# EasyEDA Pro project 仿生青蛙驱动控制板-STM32F1-3.0.eprj

# Schematic Schematic1
Create Date: 2024-03-05; Page Name: P1; Project Name: 仿生青蛙驱动控制板-STM32F1-3.0; Schematic Name: Schematic1; Update Date: 2024-03-24; Company: 嘉立创EDA; Page Size: A4; Version: V1.0
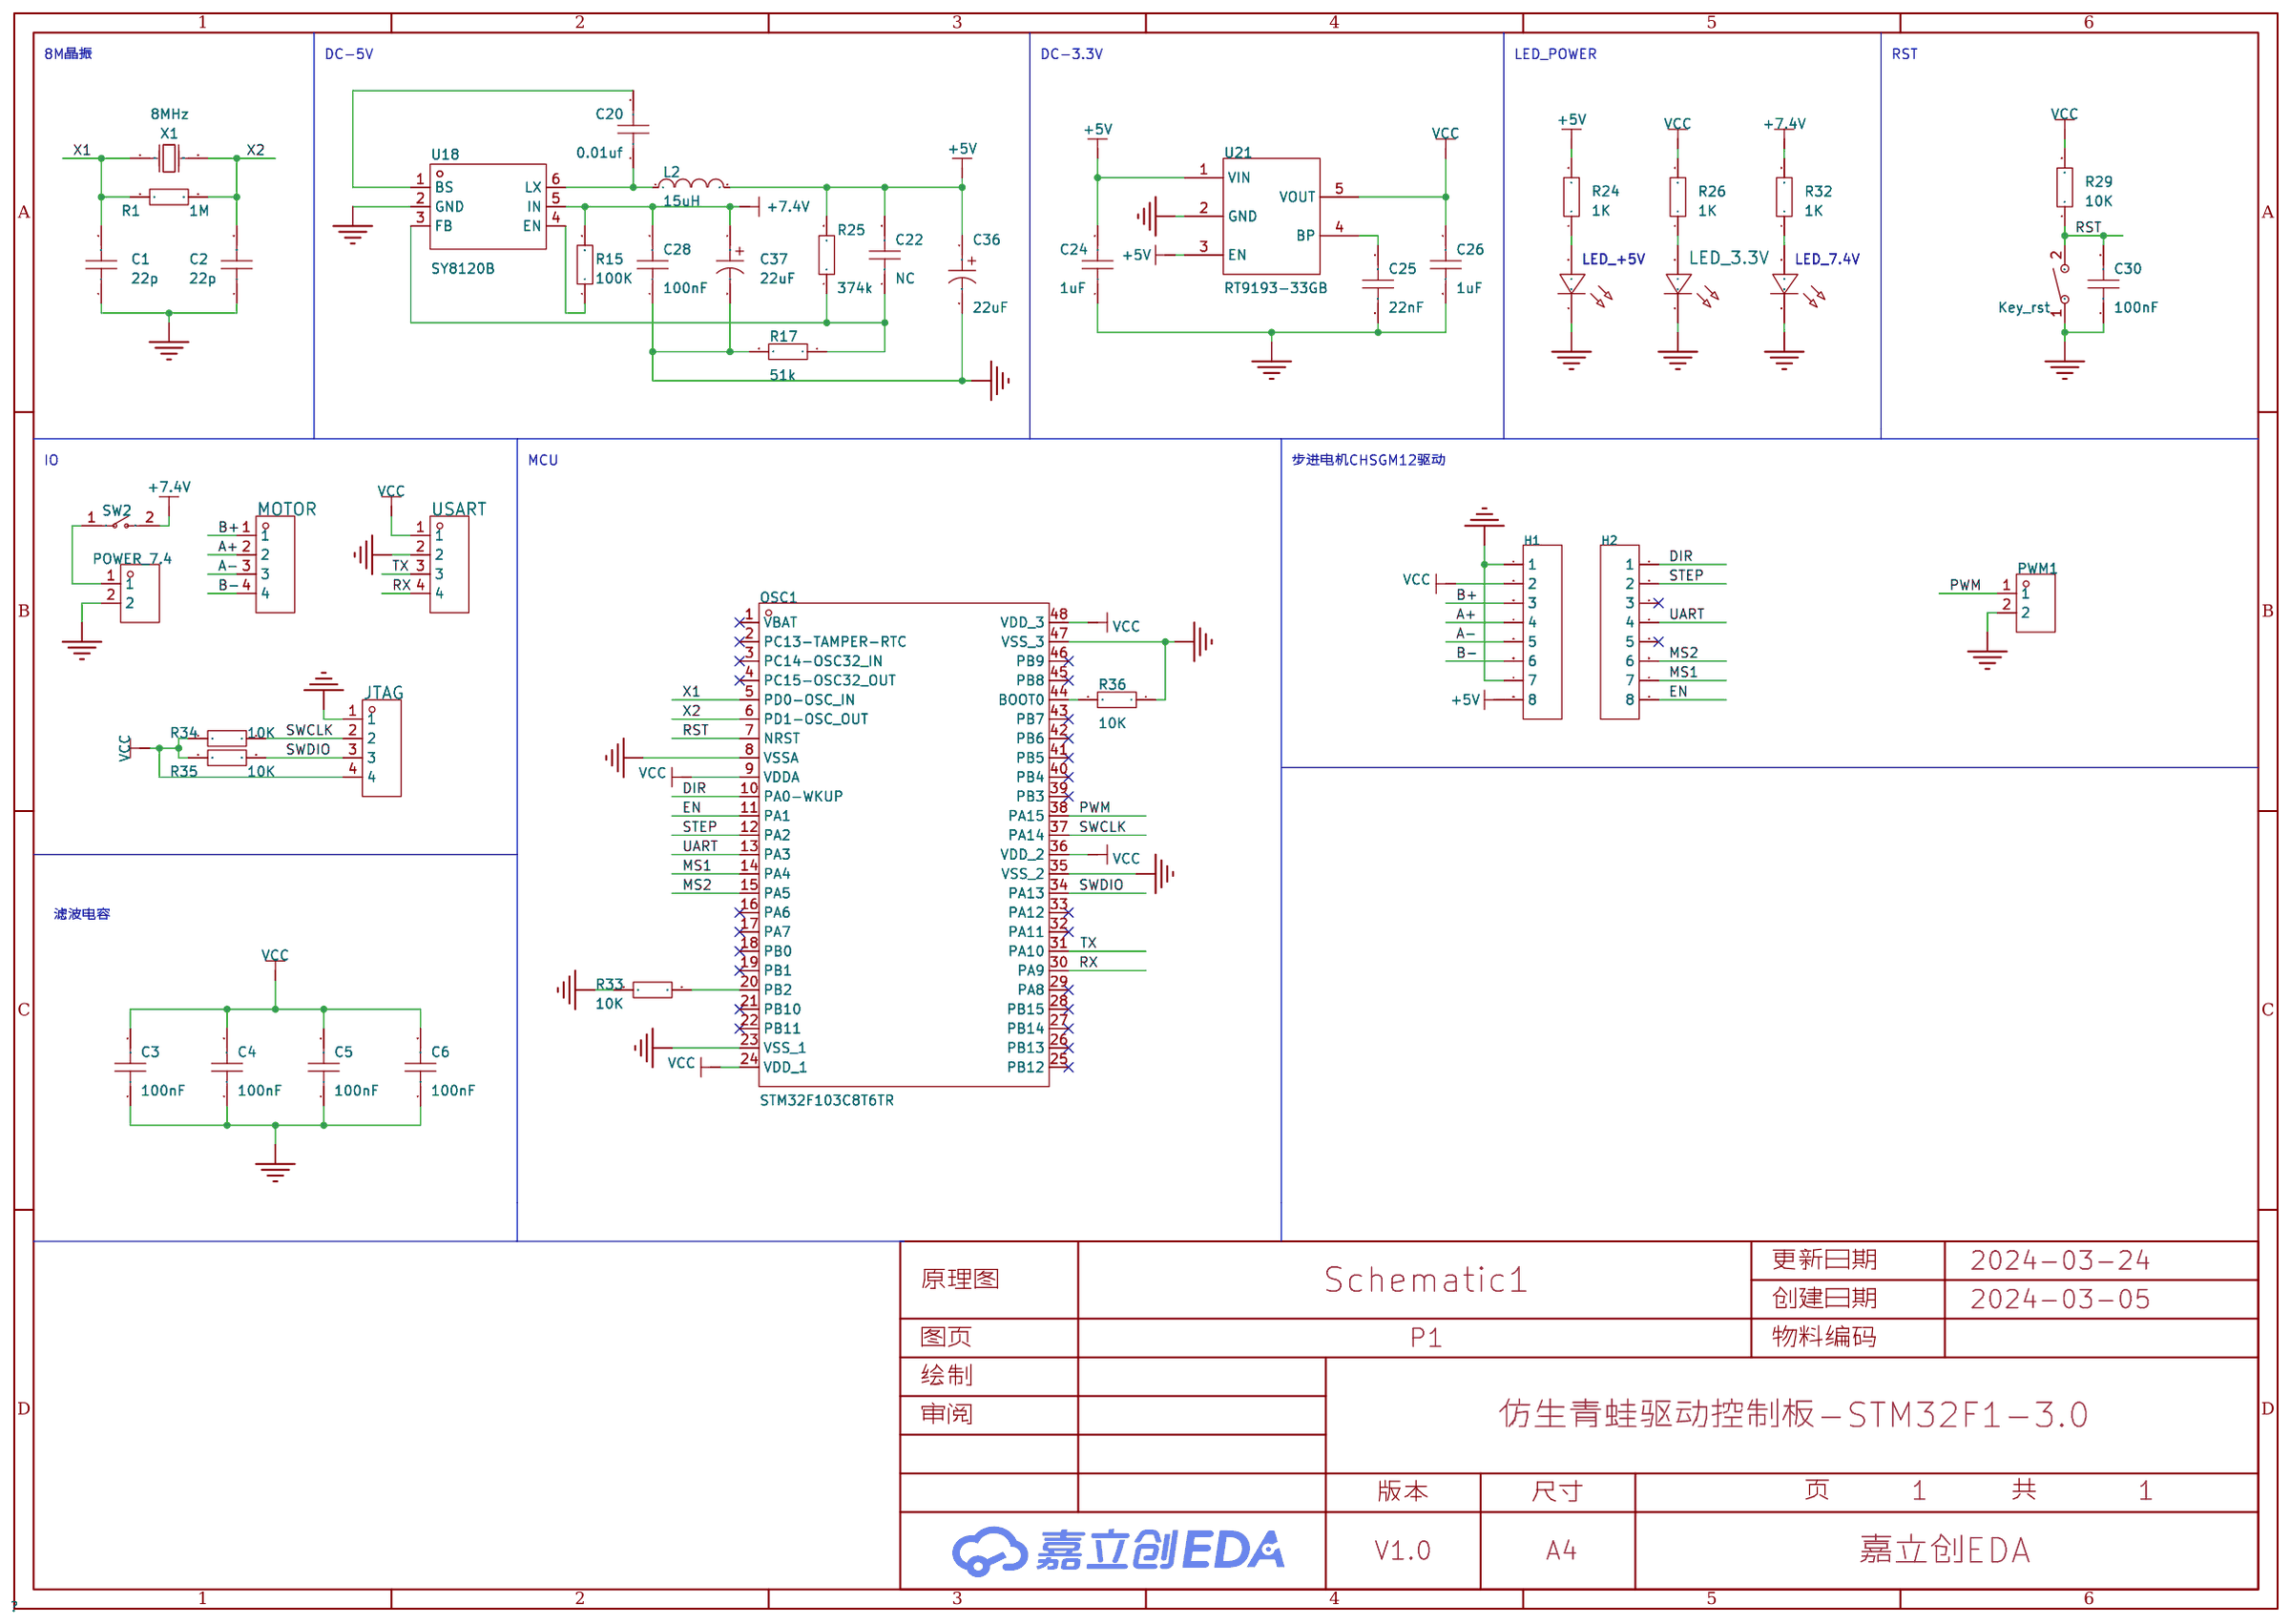
[diagram p0: schematic sheet]

## Parts
C1  22p  [c0603]
C2  22p  [c0603]
C3  100nF  [c0603]
C4  100nF  [c0603]
C5  100nF  [c0603]
C6  100nF  [c0603]
C20  0.01uf  [c0603]
C22  NC  [c0603]
C24  1uF  [c0603]
C25  22nF  [c0603]
C26  1uF  [c0603]
C28  100nF  [c0603]
C30  100nF  [c0603]
C36  22uF  [CAP-SMD_BD5.0-L5.3-W5.3-LS6.0-FD]
C37  22uF  [CAP-SMD_BD5.0-L5.3-W5.3-LS6.0-FD]
H1  -  [HDR-TH_8P-P2.54-V-F-1]
H2  -  [HDR-TH_8P-P2.54-V-F-1]
JTAG  -  [HDR-TH_4P-P2.54-V-F]
Key_rst  TS-1092S-B3D2-G  [SW-SMD_L6.1-W3.6-LS7.9]
L2  15uH  [IND-SMD_L7.0-W6.6_FXL0630]
LED_3.3V  -  [LED_0603]
LED_7.4V  -  [LED_0603]
LED_+5V  -  [LED_0603]
MOTOR  -  [HDR-TH_4P-P2.54-V-F]
OSC1  STM32F103C8T6TR  [LQFP-48_L7.0-W7.0-P0.50-LS9.0-BL]
POWER_7.4  ZX-XH2.54-2PZZ  [CONN-TH_2P-P2.50_HX25003-2A]
PWM1  ZX-XH2.54-2PZZ  [CONN-TH_2P-P2.50_HX25003-2A]
R1  1M  [r0603]
R15  100K  [r0603]
R17  51k  [r0603]
R24  1K  [r0603]
R25  374k  [r0603]
R26  1K  [r0603]
R29  10K  [r0603]
R32  1K  [r0603]
R33  10K  [r0603]
R34  10K  [r0603]
R35  10K  [r0603]
R36  10K  [r0603]
SW2  KCD11-2P-R  [SW-TH_2P-L15.0-W10.5-P5.00_KCD11-2P-R]
U18  SY8120B  [SOT-23-6_L2.9-W1.6-P0.95-LS2.8-BL]
U21  RT9193-33GB  [SOT-23-5_L3.0-W1.7-P0.95-LS2.8-BL]
USART  -  [HDR-TH_4P-P2.54-V-F]
X1  8MHz  [CRYSTAL-SMD_L5.0-W3.2]

## Library data of the parts
C1-C6 C24-C26 C28 C30 = CAP_0402: Supplier Footprint: 0402
C20 C22 = CAP_0805: Supplier Footprint: 0805
C36 C37 = RVT22UF25V67RV0047: 容值:22uF;精度:±20%;额定电压:25V;纹波电流:26mA@120Hz;等效串联电阻:-;; LCSC Part Name: 22uF ±20% 25V; Supplier Part: C2895283; Manufacturer: KNSCHA(科尼盛); Supplier Footprint: SMD,D5xL5.4mm; JLCPCB Part Class: Extended Part; Datasheet: https://atta.szlcsc.com/upload/public/pdf/source/20210913/932E3E330BEA7074461466B23B823DC6.pdf; Supplier: LCSC; Tolerance: ±20%; Rated Voltage: 25V; Ripple Current: 26mA@120Hz; φD: 5mm; L: 5.4mm; Lifetime @ Temp: 2000hrs@105℃; Operating Temperature: -55℃~+105℃
H1 H2 = HDR-F_2.54_1x8P: Supplier Part: C27438; Supplier Footprint: 插件
JTAG MOTOR USART = HDR-F_2.54_1x4P: Supplier Part: C2718488; Supplier Footprint: 插件
Key_rst = TS-1092S-B3D2-G: 电路结构:单刀单掷;按钮形状:矩形按钮;作用力:250gf;安装方式:立贴;开关长度:6.1mm;开关宽度:3.6mm;开关高度:2.5mm;带支架:不带;机械寿命:-;; LCSC Part Name: 6.1*3.6*2.5mm 立贴 轻触开关; Supplier Part: C520860; Manufacturer: Yuandi(元迪); Supplier Footprint: SMD; JLCPCB Part Class: 扩展库; Datasheet: https://atta.szlcsc.com/upload/public/pdf/source/20200424/C520860_DA5AE47D9A9DC527FC720B5FF0895739.pdf; Supplier: LCSC; Circuit: 单刀单掷; Actuator Style: 矩形按钮; Operating Force: 250gf; Mounting Style: 立贴; Switch Length: 6.1mm; Switch Width: 3.6mm; Switch Height: 2.5mm; Strike Gundam: 不带; Actuator/Cap Color: 灰色; Pin Style: 鸥翼型
L2 = FXL0630-150-M: 电感值:15uH;精度:±20%;额定电流:3A;饱和电流(Isat):4.5A;类型:一体成型电感;; LCSC Part Name: 15uH ±20% 4.5A; Supplier Part: C177243; Manufacturer: cjiang(长江微电); Supplier Footprint: SMD,6.6x7mm; JLCPCB Part Class: 扩展库; Datasheet: https://atta.szlcsc.com/upload/public/pdf/source/20230516/3A080F5AF8C87BB81C3BA86E5F60E51A.pdf; Supplier: LCSC; Tolerance: ±20%; Rated Current: 3A; Saturation Current (Isat): 4.5A; DC Resistance (DCR): 115mΩ; Type: 一体成型电感
LED_3.3V = LED_0402-R: Supplier Footprint: 0402
LED_7.4V = LED_0402-B: Supplier Footprint: 0402
LED_+5V = LED_0603-G: Supplier Footprint: 0603
OSC1 = STM32F103C8T6TR: CPU内核:CM3;程序存储容量:64KB;RAM总容量:20KB;GPIO端口数量:37;工作电压范围:2V~3.6V;CPU最大主频:72MHz;程序存储器类型:-;; Supplier Part: C2969777; Manufacturer: ST(意法半导体); Supplier Footprint: LQFP-48(7x7); JLCPCB Part Class: 扩展库; Datasheet: https://atta.szlcsc.com/upload/public/pdf/source/20220628/95EE8CB51361BFD20205E6D0986143A8.pdf; Supplier: LCSC; CPU Core: CM3; Program Storage Size: 64KB; RAM Size: 20KB; GPIO Ports Number: 37; Operating Voltage Range: 2V~3.6V; CPU Maximum Speed: 72MHz; Operating Temperature Range: -40℃~+85℃; ADC (Bit): 12bit; Universal Serial Bus: 有; Peripheral/Function: 温度传感器; Watchdog: 有; Infrared Data Association: 有; Low-Voltage Detect: 有; Direct Memory Access: 有; Internal Oscillator: 有
POWER_7.4 PWM1 = ZX-XH2.54-2PZZ: 插针结构:1x2P;间距:2.54mm;安装方式:直插;参考系列:XH;总PIN数:2P;排数:1;每排PIN数:2;行距:-;额定电流:3A;触头材质:黄铜;触头镀层:锡;工作温度范围:-25℃~+85℃;; Supplier Part: C7429632; Manufacturer: Megastar(兆星); Supplier Footprint: 插件,P=2.54mm; JLCPCB Part Class: Extended Part; Datasheet: https://atta.szlcsc.com/upload/public/pdf/source/20230619/19BA6947230AA44A04D3EDD65E618FD0.pdf; Supplier: LCSC; Pins Structure: 1x2P; Pitch: 2.54mm; Mounting Style: 直插; Reference Series: XH; Number of Pins: 2P; Number of Rows: 1; Number of PINs Per Row: 2; Current Rating (Max): 3A; Contact Material: 黄铜; Contact Plating: 锡; Operating Temperature Range: -25℃~+85℃
R1 R26 R29 R32-R35 = Res_0402: Supplier Footprint: 0402
R15 R17 R24 R25 = Res_0805: Supplier Footprint: 0805
R36 = Res_0603: Supplier Footprint: 0603
SW2 = KCD11-2P-R: 带灯:无;引脚样式:焊片;额定电流:3A;额定电压(AC):250V;额定电压(DC):-;电路结构:单刀单掷;机械寿命:1万次;; LCSC Part Name: 10.5*15mm 两脚两档跷板开关 红钮; Supplier Part: C5884414; Manufacturer: SHOU HAN(首韩); Supplier Footprint: 插件; JLCPCB Part Class: Extended Part; Datasheet: https://atta.szlcsc.com/upload/public/pdf/source/20230506/CD06DFDE35C8048D34175BFF4AF6A2C2.pdf; Supplier: LCSC; Switch Length: 15mm; Switch Width: 10.5mm; Switch Height: 17.2mm; Actuator Type: 凹面弯曲; With Lamp: 无; Pin Style: 焊片; Actuator Color: 红色; Contact Current: 3A; Voltage Rating (AC): 250V; Circuit: 单刀单掷; Mechanical Life: 1万次; Operating Temperature: 0℃~+125℃; Actuator Identifier: - O
U18 = SY8120B: LCSC Part Name: 2A, 18V, 600KHz同步降压转换器; Supplier Part: C5330397; Manufacturer: Slkor(萨科微); Supplier Footprint: SOT-23-6; JLCPCB Part Class: 扩展库; Datasheet: https://atta.szlcsc.com/upload/public/pdf/source/20221213/05E3E36F9B4BD6CBAE1D86C5271B65DD.pdf; Supplier: LCSC
U21 = RT9193-33GB: 输出类型:固定;最大输入电压:5.5V;输出电压:3.3V;最大输出电流:300mA;电源纹波抑制比(PSRR):70dB;输出极性:正极;; LCSC Part Name: 输入5.5V 输出3.3V 300mA; Supplier Part: C15651; Manufacturer: RICHTEK(立锜); Supplier Footprint: SOT-23-5; JLCPCB Part Class: 扩展库; Datasheet: https://atta.szlcsc.com/upload/public/pdf/source/20130730/1457706628575.pdf; Supplier: LCSC; Output Type: 固定; Maximum Input Voltage: 5.5V; Output Voltage: 3.3V; MAX Output Current: 300mA; Power Supply Rejection Ratio (PSRR): 70dB; Dropout Voltage: 300mV@(300mA); standby current: 130uA; Operating Temperature: -40℃~+125℃; Output Polarity: 正极; Number of Outputs: 1
X1 = X50328MSB2GI: 晶振类型:贴片晶振;频率:8MHz;常温频差:±10ppm;外接负载电容:20pF;频率稳定度(全温):±50ppm;; LCSC Part Name: 8MHz ±10ppm 20pF YSX530GA; Supplier Part: C115962; Manufacturer: YXC(扬兴晶振); Supplier Footprint: SMD5032; JLCPCB Part Class: Basic Part; Datasheet: https://atta.szlcsc.com/upload/public/pdf/source/20230220/0EBFFB9D6D8CE6A211407822BBB6C516.pdf; Supplier: LCSC; Crystal Type: 贴片晶振; Normal temperature Frequency Tolerance: ±10ppm; External load capacitor: 20pF; Frequency Stability(Full temperature range): ±50ppm; Operating Temperature: -40℃~+85℃

## Nets
+5V: C22.2 C24.2 C36.1 H1.8 L2.2 R24.2 R25.2 U21.1(VIN) U21.3(EN)
+7.4V: C28.2 C37.1 R15.2 R32.2 SW2.2 U18.5(IN)
GND: C1.1 C2.1 C3.1 C4.1 C5.1 C6.1 C24.1 C25.2 C26.2 C28.1 C30.1 C36.2 C37.2 H1.1 H1.7 JTAG.1 Key_rst.1 LED_3.3V.1(C) LED_7.4V.1(C) LED_+5V.1(C) OSC1.8(VSSA) OSC1.23(VSS_1) OSC1.35(VSS_2) OSC1.47(VSS_3) POWER_7.4.2 PWM1.2 R17.2 R33.1 R36.1 U18.2(GND) U21.2(GND) USART.2
VCC: C3.2 C4.2 C5.2 C6.2 C26.1 H1.2 JTAG.4 OSC1.9(VDDA) OSC1.24(VDD_1) OSC1.36(VDD_2) OSC1.48(VDD_3) R26.2 R29.2 R34.1 R35.1 U21.5(VOUT) USART.1
A+: H1.4 MOTOR.2
A-: H1.5 MOTOR.3
B+: H1.3 MOTOR.1
B-: H1.6 MOTOR.4
DIR: H2.1 OSC1.10(PA0-WKUP)
EN: H2.8 OSC1.11(PA1)
MS1: H2.7 OSC1.14(PA4)
MS2: H2.6 OSC1.15(PA5)
PWM: OSC1.38(PA15) PWM1.1
RST: C30.2 Key_rst.2 OSC1.7(NRST) R29.1
RX: OSC1.30(PA9) USART.4
STEP: H2.2 OSC1.12(PA2)
SWCLK: JTAG.2 OSC1.37(PA14) R34.2
SWDIO: JTAG.3 OSC1.34(PA13) R35.2
TX: OSC1.31(PA10) USART.3
UART: H2.4 OSC1.13(PA3)
X1: C1.2 OSC1.5(PD0-OSC_IN) R1.1 X1.1(OSC1)
X2: C2.2 OSC1.6(PD1-OSC_OUT) R1.2 X1.2(OSC2)
$1N1980: C20.1 L2.1 U18.6(LX)
$1N1981: C20.2 U18.1(BS)
$1N1982: R15.1 U18.4(EN)
$1N1985: LED_+5V.2(A) R24.1
$1N3570: C25.1 U21.4(BP)
$1N3715: LED_3.3V.2(A) R26.1
$1N6481: LED_7.4V.2(A) R32.1
$1N6675: OSC1.20(PB2) R33.2
$1N10736: C22.1 R17.1 R25.1 U18.3(FB)
$1N12968: POWER_7.4.1 SW2.1
$1N16517: OSC1.44(BOOT0) R36.2

Not connected (* = marked no-connect by the designer): H2 3* 5*; OSC1 1(VBAT)* 2(PC13-TAMPER-RTC)* 3(PC14-OSC32_IN)* 4(PC15-OSC32_OUT)* 16(PA6)* 17(PA7)* 18(PB0)* 19(PB1)* 21(PB10)* 22(PB11)* 25(PB12)* 26(PB13)* 27(PB14)* 28(PB15)* 29(PA8)* 32(PA11)* 33(PA12)* 39(PB3)* 40(PB4)* 41(PB5)* 42(PB6)* 43(PB7)* 45(PB8)* 46(PB9)*

## Notes on the sheet
- 8M晶振
- DC-5V
- DC-3.3V
- LED_POWER
- RST
- IO
- MCU
- 步进电机CHSGM12驱动
- 滤波电容

# Board PCB1
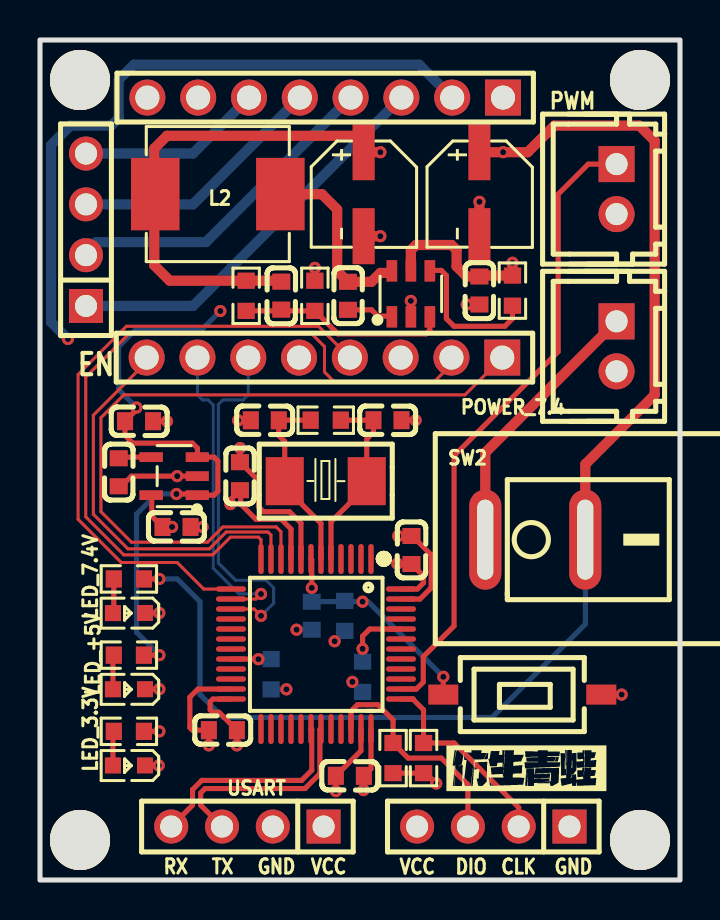
[diagram p1: board, top side]
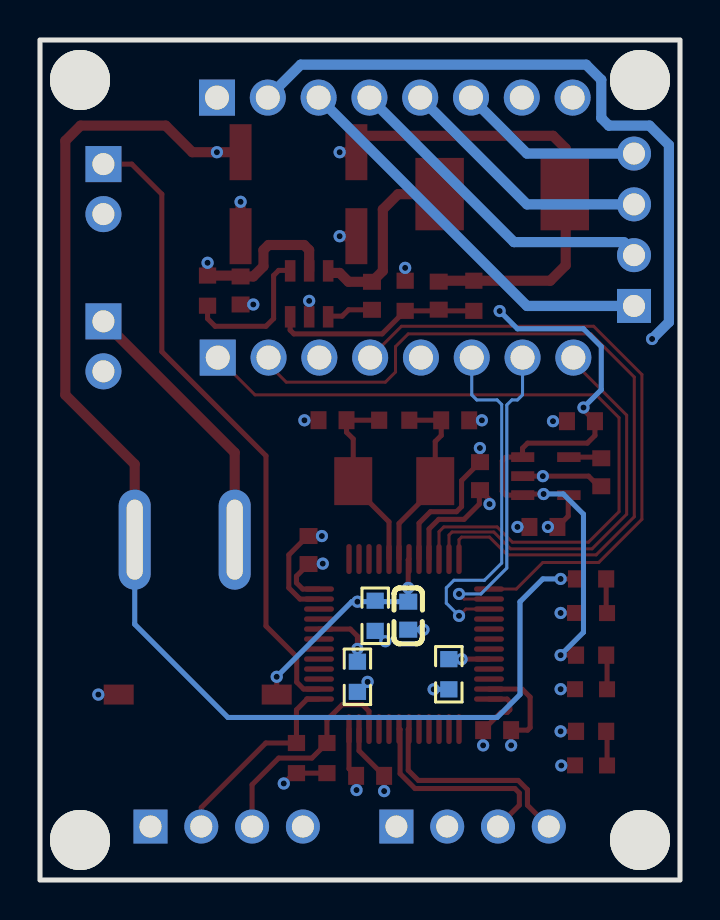
[diagram p2: board, bottom side, seen from below]

Outline 32 x 42 mm; copper layers: Top Layer, POWER, GND, Bottom Layer. Coordinates in mm from the lower left corner of the outline.
Outline path: rectangle 0,42 32,0
Stack: Top Layer 0.035mm 外层铜厚1oz / Dielectric1 0.2104mm 7628 RC49% 8.6mil / POWER 0.0152mm 内层铜厚 / Dielectric2 1.065mm 1.1mm H/HOZ 含铜 / GND 0.0152mm 内层铜厚 / Dielectric3 0.2104mm 7628 RC49% 8.6mil / Bottom Layer 0.035mm 外层铜厚1oz

## Design rules (mm)
net RX: USART
net TX: USART
template: JLCPCB Capability(Two Layers Board)
spacing copperThickness1oz (default): track to track 0.102, other pairs 0.152 to 0.3
spacing copperThickness2oz: track to track 0.203, other pairs 0.152 to 0.3
track width copperThickness1oz (default): min 0.127, default 0.254, max 2.54
track width copperThickness2oz: min 0.203, default 0.254, max 2.54
differential pair differentialPair (default): width min 0.127, default 0.254, max 2.54; gap min 0.152, default 0.152
via viaSize (default): diameter min 0.5, default 0.61, max 10; hole min 0.3, default 0.305, max 6.3

## Placement (name value [footprint] x y rotation side)
C1  22p  [c0603]  17.37 22.99 180 top
C2  22p  [c0603]  11.24 22.98 0 top
C3  100nF  [c0603]  9.14 7.49 0 top
C4  100nF  [c0603]  15.49 5.21 0 top
C5  100nF  [c0603]  18.57 16.5 270 top
C6  100nF  [c0603]  10 20.19 270 top
C20  0.01uf  [c0603]  15.4 29.21 270 top
C22  NC  [c0603]  12.06 29.22 90 top
C24  1uF  [c0603]  4.95 22.94 180 top
C25  22nF  [c0603]  3.94 20.39 270 top
C26  1uF  [c0603]  6.83 17.65 0 top
C28  100nF  [c0603]  21.97 29.48 90 top
C30  100nF  [c0603]  13.59 13.22 90 bottom
C36  22uF  [CAP-SMD_BD5.0-L5.3-W5.3-LS6.0-FD]  16.18 34.29 270 top
C37  22uF  [CAP-SMD_BD5.0-L5.3-W5.3-LS6.0-FD]  21.97 34.29 270 top
H1  -  [HDR-TH_8P-P2.54-V-F-1]  14.26 39.12 180 top
H2  -  [HDR-TH_8P-P2.54-V-F-1]  14.22 26.12 180 top
JTAG  -  [HDR-TH_4P-P2.54-V-F]  22.67 2.67 180 top
Key_rst  TS-1092S-B3D2-G  [SW-SMD_L6.1-W3.6-LS7.9]  24.12 9.27 180 top
L2  15uH  [IND-SMD_L7.0-W6.6_FXL0630]  8.89 34.3 0 top
LED_3.3V  -  [LED_0603]  4.4 5.72 180 top
LED_7.4V  -  [LED_0603]  4.4 13.34 180 top
LED_+5V  -  [LED_0603]  4.4 9.53 180 top
MOTOR  -  [HDR-TH_4P-P2.54-V-F]  2.3 32.51 90 top
NOREF  -  [Pad_e2038]  2 40 0 top
NOREF#2  -  [Pad_e2041]  2 2 0 top
NOREF#3  -  [Pad_e2040]  30 40 0 top
NOREF#4  -  [Pad_e2042]  30 2 0 top
OSC1  STM32F103C8T6TR  [LQFP-48_L7.0-W7.0-P0.50-LS9.0-BL]  13.8 11.8 180 top
POWER_7.4  ZX-XH2.54-2PZZ  [CONN-TH_2P-P2.50_HX25003-2A]  28.83 26.68 270 top
PWM1  ZX-XH2.54-2PZZ  [CONN-TH_2P-P2.50_HX25003-2A]  28.83 34.54 270 top
R1  1M  [r0603]  14.29 22.99 180 top
R15  100K  [r0603]  23.62 29.47 90 top
R17  51k  [r0603]  13.74 29.21 90 top
R24  1K  [r0603]  4.44 11.24 0 top
R25  374k  [r0603]  10.31 29.21 90 top
R26  1K  [r0603]  4.44 7.43 0 top
R29  10K  [r0603]  15.24 13.21 270 bottom
R32  1K  [r0603]  4.44 15.05 0 top
R33  10K  [r0603]  11.56 10.29 90 bottom
R34  10K  [r0603]  19.18 6.1 90 top
R35  10K  [r0603]  17.65 6.1 90 top
R36  10K  [r0603]  16.13 10.16 90 bottom
SW2  KCD11-2P-R  [SW-TH_2P-L15.0-W10.5-P5.00_KCD11-2P-R]  24.76 17.02 0 top
U18  SY8120B  [SOT-23-6_L2.9-W1.6-P0.95-LS2.8-BL]  18.54 29.31 0 top
U21  RT9193-33GB  [SOT-23-5_L3.0-W1.7-P0.95-LS2.8-BL]  6.71 20.19 90 top
USART  -  [HDR-TH_4P-P2.54-V-F]  10.37 2.67 180 top
X1  8MHz  [CRYSTAL-SMD_L5.0-W3.2]  14.29 19.94 180 top

## Footprints (pads in the part's own frame, mm; a bottom-side part is the same pattern mirrored in y, then rotated)
c0603
  rect 0.8x0.9 smd: 1(-0.7,0) 2(0.7,0)
CAP-SMD_BD5.0-L5.3-W5.3-LS6.0-FD
  rect 2.8x1.1 smd: 1(-2.1,0) 2(2.1,0)
CONN-TH_2P-P2.50_HX25003-2A
  rect 1.8x1.8 hole 1.1: 1(-1.25,0)
  round 1.8 hole 1.1: 2(1.25,0)
CRYSTAL-SMD_L5.0-W3.2
  rect 1.9x2.4 smd: 1(-2.05,0) 2(2.05,0)
HDR-TH_4P-P2.54-V-F
  rect 1.7x1.7 hole 1.1: 1(-3.81,0)
  round 1.7 hole 1.1: 2(-1.27,0) 3(1.27,0) 4(3.81,0)
HDR-TH_8P-P2.54-V-F-1
  rect 1.8x1.8 hole 1.2: 1(-8.89,0)
  round 1.8 hole 1.2: 2(-6.35,0) 3(-3.81,0) 4(-1.27,0) 5(1.27,0) 6(3.81,0) 7(6.35,0) 8(8.89,0)
IND-SMD_L7.0-W6.6_FXL0630
  rect 2.424x3.62 smd: 1(3.128,0) 2(-3.128,0)
LED_0603
  rect 0.8x0.8 smd: 1(-0.851,-0.01) 2(0.75,-0.005)
LQFP-48_L7.0-W7.0-P0.50-LS9.0-BL
  oval 0.27x1.5 smd: 1(-2.75,-4.25) 2(-2.25,-4.25) 3(-1.75,-4.25) 4(-1.25,-4.25) 5(-0.75,-4.25) 6(-0.25,-4.25) 7(0.25,-4.25) 8(0.75,-4.25) 9(1.25,-4.25) 10(1.75,-4.25) 11(2.25,-4.25) 12(2.75,-4.25) 25(2.75,4.25) 26(2.25,4.25) 27(1.75,4.25) 28(1.25,4.25) 29(0.75,4.25) 30(0.25,4.25) 31(-0.25,4.25) 32(-0.75,4.25) 33(-1.25,4.25) 34(-1.75,4.25) 35(-2.25,4.25) 36(-2.75,4.25)
  oval 1.5x0.27 smd: 13(4.25,-2.75) 14(4.25,-2.25) 15(4.25,-1.75) 16(4.25,-1.25) 17(4.25,-0.75) 18(4.25,-0.25) 19(4.25,0.25) 20(4.25,0.75) 21(4.25,1.25) 22(4.25,1.75) 23(4.25,2.25) 24(4.25,2.75) 37(-4.25,2.75) 38(-4.25,2.25) 39(-4.25,1.75) 40(-4.25,1.25) 41(-4.25,0.75) 42(-4.25,0.25) 43(-4.25,-0.25) 44(-4.25,-0.75) 45(-4.25,-1.25) 46(-4.25,-1.75) 47(-4.25,-2.25) 48(-4.25,-2.75)
Pad_e2038
  round 3 hole 3: 1(0,0)
Pad_e2040
  round 3 hole 3: 1(0,0)
Pad_e2041
  round 3 hole 3: 1(0,0)
Pad_e2042
  round 3 hole 3: 1(0,0)
r0603
  rect 0.806x0.864 smd: 1(-0.753,0) 2(0.753,0)
SOT-23-5_L3.0-W1.7-P0.95-LS2.8-BL
  rect 0.49x1.157 smd: 1(-0.95,-1.153) 2(0,-1.153) 3(0.95,-1.153)
  rect 0.49x1.175 smd: 4(0.95,1.153) 5(-0.95,1.153)
SOT-23-6_L2.9-W1.6-P0.95-LS2.8-BL
  rect 0.532x1.072 smd: 1(-0.95,-1.149) 2(0,-1.149) 3(0.95,-1.149) 4(0.95,1.149) 5(0,1.149) 6(-0.95,1.149)
SW-SMD_L6.1-W3.6-LS7.9
  rect 1.5x1 smd: 1(-3.95,0) 2(3.95,0)
SW-TH_2P-L15.0-W10.5-P5.00_KCD11-2P-R
  oval 1.6x5 hole 0.8x4: 1(-2.5,0) 2(2.5,0)

## Nets
As in the schematic, except:
GND: C1.1 C2.1 C3.1 C4.1 C5.1 C6.1 C24.1 C25.2 C26.2 C28.1 C30.1 C36.2 C37.2 H1.1 H1.7 JTAG.1 Key_rst.1 LED_3.3V.1 LED_7.4V.1 LED_+5V.1 NOREF.1 NOREF#2.1 NOREF#3.1 NOREF#4.1 OSC1.8 OSC1.23 OSC1.35 OSC1.47 POWER_7.4.2 PWM1.2 R17.2 R33.1 R36.1 U18.2 U21.2 USART.2

Pads without a net: H2 3 5; OSC1 1 2 3 4 16 17 18 19 21 22 25 26 27 28 29 32 33 39 40 41 42 43 45 46

## Via types
v1: diameter 0.61, hole 0.305, Top Layer to Bottom Layer, 45 vias

## Routing (per net, layer and track width the routed paths; a pad name or vN(x,y) marks a point on that pad's centre or on a via; arc(x,y) is an arc through that point)
+5V: length 55.6
  Top Layer w0.254: v1(4.83,23.62) 4.83,23.51 C24.2 4.25,22.22 4.63,21.84 7.62,21.84 7.87,21.59 7.87,21.15 U21.3 8.7,21.14 8.89,20.95 8.89,19.43 8.7,19.24 U21.1 7.81,19.3 v1(6.82,19.3) ; R24.2 v1(5.97,11.24)
  Top Layer w0.508: C22.2 12.02,29.96 R25.2 6.49,29.96 5.72,30.73 5.72,34.25 ; v1(17.02,36.39) C36.1 16.18,37.03 16,37.21 6.35,37.21 5.72,36.58 5.72,34.25 ; 5.72,34.25 L2.2
  Bottom Layer w0.254: v1(4.83,23.62) 3.94,24.51 3.94,26.67 4.83,27.56 8.13,27.56 v1(9.02,28.45) ; v1(5.97,11.24) 4.83,12.39 4.83,18.29 5.84,19.3 6.86,19.3
+7.4V: length 72.8
  Top Layer w0.254: R32.2 v1(5.97,15.05)
  Top Layer w0.508: v1(23.62,30.86) 23.62,30.22 22.02,30.22 C28.2 21.34,30.18 20.83,30.68 20.83,31.5 20.57,31.75 18.8,31.75 18.54,31.5 U18.5 ; SW2.2 27.26,20.79 30.73,24.26 30.73,36.96 29.97,37.72 25.71,37.72 24.38,36.39 v1(23.16,36.39) C37.1
  Bottom Layer w0.254: SW2.2 27.26,12.79 22.61,8.13 9.14,8.13 8,9.27 8,13.91 6.86,15.05 v1(5.97,15.05)
GND: length 38.6
  Top Layer w0.254: C2.1 v1(9.91,22.98) ; C24.1 v1(6.35,22.94) ; R17.2 v1(13.74,30.61) ; LED_+5V.1 v1(5.97,9.54) ; 10,21.46 C6.1 10.92,19.97 10.92,18.67 11.18,18.42 12.48,18.42 13.05,17.84 13.05,16.05 ; 16.05,7.55 16.05,6.46 C4.1 v1(14.79,4.44) ; Key_rst.1 v1(29.08,9.27) ; U21.2 v1(6.86,20.19) 4.57,20.19 4.07,19.69 C25.2 ; v1(18.54,28.96) U18.2 ; 18.05,14.05 19,14.05 19.56,14.61 19.56,16.26 18.62,17.2 C5.1 v1(17.91,17.2) ; LED_3.3V.1 5.84,5.73 ; OSC1.23 7.9,9.55 7.49,9.14 7.49,7.62 7.62,7.49 C3.1 v1(8.44,6.73) ; C26.2 v1(8.13,17.65) ; C1.1 18.67,22.99 ; LED_7.4V.1 v1(5.97,13.35)
  Top Layer w0.508: C36.2 v1(17.02,32.19) ; C37.2 v1(21.97,33.91) ; C28.1 v1(21.34,28.78)
  Bottom Layer w0.254: C30.1 v1(12.83,12.52) ; R36.1 15.63,9.91 v1(15.62,9.91) ; R33.1 v1(12.32,9.53)
  vias: v1(5.94,5.72) v1(10,21.6) v1(18.78,22.98)
VCC: length 56.1
  Top Layer w0.254: v1(19.81,4.83) 19.3,5.34 R34.1 R35.1 ; OSC1.24 8.65,9.05 8.51,8.91 8.51,8.51 8.64,8.38 8.96,8.38 C3.2 v1(9.84,6.73) ; R26.2 v1(5.97,7.43) ; 18.05,14.55 18.87,14.55 19.18,14.86 19.18,15.19 C5.2 17.91,15.8 ; v1(9.53,18.8) 9.53,19.02 C6.2 10.03,19.46 10.03,18.8 10.79,18.03 12.06,18.03 12.55,17.55 OSC1.9 ; 16.19,4.57 C4.2 16.55,5.56 OSC1.36 ; U21.5 5.59,19.21 5.59,18.19 C26.1 v1(6.6,17.65)
  Bottom Layer w0.254: R29.2 15.24,12.45 v1(14.73,11.94)
  Bottom Layer w0.508: H1.2 18.96,40.77 4.69,40.77 3.94,40.01 3.94,38.1 3.56,37.72 1.52,37.72 0.55,36.75 0.55,27.89 v1(1.4,27.05)
  vias: v1(16.17,4.5) v1(17.86,15.82)
A+: length 15.7
  Bottom Layer w0.508: 2.79,31.9 8.3,31.9 H1.4
A-: length 12.9
  Bottom Layer w0.508: MOTOR.3 7.65,33.78 H1.5
B+: length 20.1
  Bottom Layer w0.508: MOTOR.1 7.65,28.7 H1.3
B-: length 9.3
  Bottom Layer w0.508: H1.6 7.65,36.32 MOTOR.4
DIR: length 37.4
  Top Layer w0.152: H2.1 21.25,24.26 4.19,24.26 3.05,23.11 3.05,18.42 4.57,16.89 8.38,16.89 9.14,17.65 11.81,17.65 12.05,17.42 12.05,16.05
EN: length 20.1
  Top Layer w0.152: OSC1.11 11.55,17.25 11.4,17.4 9.31,17.4 8.47,16.56 4.4,16.56 2.67,18.29 2.67,23.24 5.33,25.91 H2.8
MS1: length 15.5
  Top Layer w0.152: v1(11.05,14.3) 10.79,14.05 OSC1.14
  Bottom Layer w0.152: 7.87,26.12 7.87,24.26 8.13,24 8.41,24 8.66,23.75 8.66,15.6 9.96,14.3 v1(11.05,14.3)
MS2: length 18.1
  Top Layer w0.152: OSC1.15 10.71,13.55 v1(11.05,13.21)
  Bottom Layer w0.152: H2.6 10.41,24.26 10.16,24 9.14,24 8.92,23.78 8.92,15.85 9.78,14.99 11.3,14.99 11.68,14.61 11.68,13.84 v1(11.05,13.21)
PWM: length 32
  Top Layer w0.254: PWM1.1 27.41,35.79 25.91,34.29 25.91,26.42 20.7,21.21 20.7,12.7 19.16,11.16 19.16,9.89 18.82,9.55 18.05,9.55
RST: length 11.2
  Top Layer w0.254: OSC1.7 13.59,16.01 v1(13.59,14.61) ; 20.16,9.27 v1(20.16,10.16)
  Bottom Layer w0.254: 13.59,14.61 C30.2 15.19,13.92 ; v1(20.16,10.16) 16.41,13.92 v1(16.13,13.92) 15.19,13.92 ; 15.19,13.92 R29.1
RX: length 10.7
  Top Layer w0.254: OSC1.30 13.57,7.55 13.59,7.53 13.59,5.49 13.08,4.98 8.09,4.98 7.63,4.52 7.63,3.74 USART.4
STEP: length 39.6
  Top Layer w0.152: 11.05,16.05 11.05,17.02 10.92,17.14 9.53,17.14 8.64,16.26 4.19,16.26 2.29,18.16 2.29,25.15 4.44,27.31 13.59,27.31 14.22,26.67 14.22,25.4 14.73,24.89 19.69,24.89 20.57,25.78 H2.2
SWCLK: length 10.1
  Top Layer w0.254: 18.05,9.05 18.64,9.05 19.18,8.51 R34.2 20.71,6.85 23.94,3.62 JTAG.2
SWDIO: length 11.3
  Top Layer w0.254: JTAG.3 21.4,4.77 20.07,6.1 18.41,6.1 R35.2 17.65,8 16.89,8.76 15.88,8.76 15.55,8.44 OSC1.34
TX: length 10.8
  Top Layer w0.254: 14.05,7.55 14.02,7.55 14,7.53 14,5.32 13.25,4.57 8.25,4.57 8.03,4.35 8.03,3.74 USART.3
UART: length 31.6
  Top Layer w0.152: OSC1.13 8.19,14.55 6.86,15.88 4.06,15.88 1.91,18.03 1.91,25.27 4.32,27.69 13.93,27.69 H2.4
X1: length 9.5
  Top Layer w0.254: 15.04,22.99 C1.2 16.67,22.39 16.34,22.05 X1.1 16.34,19.7 14.55,17.91 OSC1.5
X2: length 9.4
  Top Layer w0.254: R1.2 11.95,22.99 C2.2 11.94,22.98 11.94,22.22 12.24,21.92 X1.2 12.24,19.64 14.05,17.83 14.05,16.05
$1N1980: length 9.4
  Top Layer w0.508: L2.1 12.02,34.29 14.1,34.29 14.86,33.53 14.86,30.45 C20.1 16.57,29.91 17.02,30.35 17.49,30.35 U18.6
$1N1981: length 2.3
  Top Layer w0.254: U18.1 17.56,28.19 16.89,28.19 16.57,28.51 C20.2
$1N1982: length 7.4
  Top Layer w0.254: U18.4 19.52,30.48 20.07,30.48 20.32,30.23 20.32,28.07 20.7,27.69 23.24,27.69 23.62,28.07 R15.1
$1N1985: length 1.7
  Top Layer w0.254: 3.69,11.24 3.65,11.2 LED_+5V.2
$1N3570: length 1.6
  Top Layer w0.254: C25.1 3.99,21.14 U21.4
$1N3715: length 1.7
  Top Layer w0.254: 3.69,7.43 3.65,7.39 LED_3.3V.2
$1N6481: length 1.7
  Top Layer w0.254: LED_7.4V.2 3.69,13.39 3.69,15.05
$1N6675: length 2
  Top Layer w0.254: v1(10.92,11.04) 10.91,11.05 OSC1.20
  Bottom Layer w0.254: R33.2 v1(10.92,11.04)
$1N10736: length 10.5
  Top Layer w0.254: R25.1 12,28.46 C22.1 12.13,28.46 R17.1 14.89,27.31 19.3,27.31 19.49,27.49 U18.3
$1N12968: length 13.6
  Top Layer w0.508: POWER_7.4.1 22.26,21.37 SW2.1
$1N16517: length 3.3
  Top Layer w0.254: v1(16.13,11.56) 16.13,12.19 16.49,12.55 18.05,12.55
  Bottom Layer w0.254: R36.2 v1(16.13,11.56)

## Copper pours and planes (outline as drawn; the poured copper is in the pictures)
+5V on POWER: 0.26,41.74 24.64,41.74 24.64,27.86 0.26,27.86
+7.4V on POWER: 20.22,41.74 31.74,41.74 31.74,12.19 20.22,12.19
GND on GND: 0.26,41.74 31.74,41.74 31.74,0.26 0.26,0.26
VCC on POWER: 0.26,27.6 31.74,27.6 31.74,0.26 0.26,0.26

Small or netless copper shapes (teardrops, artwork), in the pictures only: 16 on POWER, 32 on GND

## Text on the board
Top Silkscreen Layer: RX | TX | GND | VCC | DIO | CLK | PWM | EN
